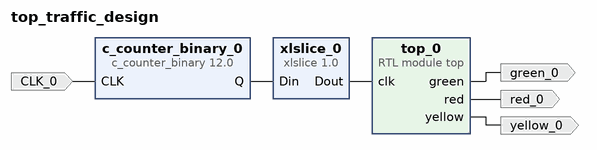
[diagram p0: block diagram of the top level]
# Vivado block design top_traffic_design, xc7a35tcpg236-1, Vivado 2023.1
create_bd_design top_traffic_design

create_bd_port -dir I -type clk CLK_0
set_property -dict {CONFIG.FREQ_HZ 10000000} [get_bd_ports CLK_0]
create_bd_port -dir O green_0
create_bd_port -dir O yellow_0
create_bd_port -dir O red_0

create_bd_cell -type ip -vlnv xilinx.com:ip:c_counter_binary:12.0 c_counter_binary_0
set_property -dict {CONFIG.Output_Width 25} [get_bd_cells c_counter_binary_0]
create_bd_cell -type ip -vlnv xilinx.com:ip:xlslice:1.0 xlslice_0
set_property -dict {CONFIG.DIN_FROM 14 CONFIG.DIN_TO 14 CONFIG.DIN_WIDTH 25} [get_bd_cells xlslice_0]
create_bd_cell -type module -reference top top_0

# ---- connections ----

connect_bd_net -net CLK_0_1 [get_bd_ports CLK_0] [get_bd_pins c_counter_binary_0/CLK]
connect_bd_net [get_bd_pins c_counter_binary_0/Q] [get_bd_pins xlslice_0/Din]
connect_bd_net [get_bd_pins top_0/green] [get_bd_ports green_0]
connect_bd_net [get_bd_pins top_0/red] [get_bd_ports red_0]
connect_bd_net [get_bd_pins top_0/yellow] [get_bd_ports yellow_0]
connect_bd_net [get_bd_pins xlslice_0/Dout] [get_bd_pins top_0/clk]

validate_bd_design
save_bd_design
